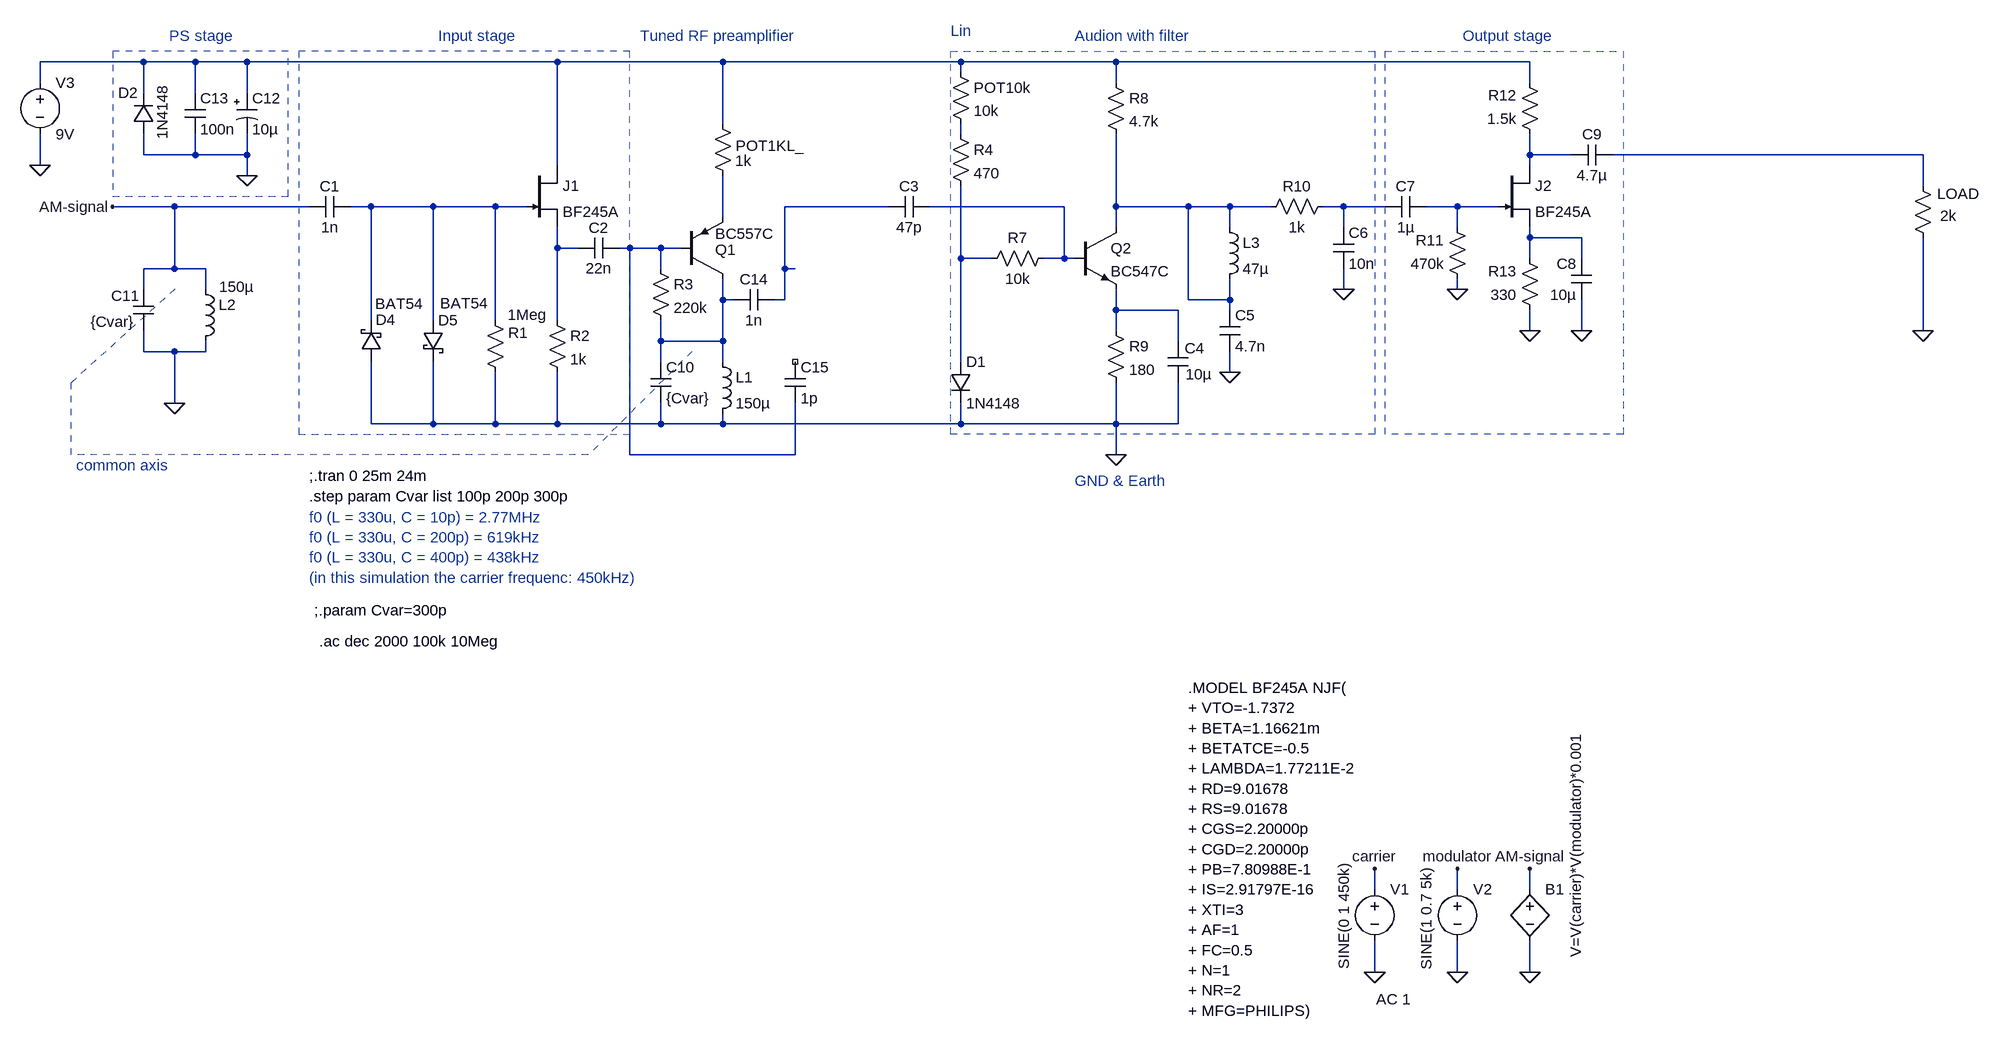
[diagram p0: schematic audion-receiver-4.asc]
audion-receiver-4.asc, the LTspice schematic file:
Version 4.1
SHEET 1 2156 1116
WIRE -688 -368 -848 -368
WIRE -608 -368 -688 -368
WIRE -528 -368 -608 -368
WIRE -48 -368 -528 -368
WIRE 208 -368 -48 -368
WIRE 576 -368 208 -368
WIRE 816 -368 576 -368
WIRE 1456 -368 816 -368
WIRE 576 -352 576 -368
WIRE -848 -336 -848 -368
WIRE 816 -336 816 -368
WIRE 1456 -336 1456 -368
WIRE -688 -320 -688 -368
WIRE -608 -320 -608 -368
WIRE -528 -320 -528 -368
WIRE 208 -272 208 -368
WIRE 576 -256 576 -272
WIRE -688 -224 -688 -256
WIRE -608 -224 -608 -256
WIRE -608 -224 -688 -224
WIRE -528 -224 -528 -256
WIRE -528 -224 -608 -224
WIRE 1456 -224 1456 -256
WIRE 1520 -224 1456 -224
WIRE 2064 -224 1584 -224
WIRE -848 -208 -848 -256
WIRE -48 -208 -48 -368
WIRE 1456 -208 1456 -224
WIRE -528 -192 -528 -224
WIRE 2064 -176 2064 -224
WIRE -640 -144 -736 -144
WIRE -432 -144 -640 -144
WIRE -336 -144 -368 -144
WIRE -240 -144 -336 -144
WIRE -144 -144 -240 -144
WIRE -96 -144 -144 -144
WIRE 464 -144 304 -144
WIRE 736 -144 528 -144
WIRE 816 -144 816 -256
WIRE 928 -144 816 -144
WIRE 992 -144 928 -144
WIRE 1056 -144 992 -144
WIRE 1168 -144 1136 -144
WIRE 1232 -144 1168 -144
WIRE 1344 -144 1296 -144
WIRE 1408 -144 1344 -144
WIRE 208 -128 208 -192
WIRE 816 -112 816 -144
WIRE 992 -112 992 -144
WIRE 1168 -112 1168 -144
WIRE 1344 -112 1344 -144
WIRE 1456 -96 1456 -112
WIRE 1536 -96 1456 -96
WIRE -48 -80 -48 -112
WIRE -16 -80 -48 -80
WIRE 64 -80 48 -80
WIRE 112 -80 64 -80
WIRE 144 -80 112 -80
WIRE 576 -64 576 -176
WIRE 624 -64 576 -64
WIRE 736 -64 736 -144
WIRE 736 -64 704 -64
WIRE 752 -64 736 -64
WIRE 1456 -64 1456 -96
WIRE 1536 -64 1536 -96
WIRE -640 -48 -640 -144
WIRE -640 -48 -688 -48
WIRE -592 -48 -640 -48
WIRE 112 -48 112 -80
WIRE 304 -48 304 -144
WIRE 320 -48 304 -48
WIRE -688 -16 -688 -48
WIRE -592 -16 -592 -48
WIRE 1168 -16 1168 -48
WIRE 1344 -16 1344 -32
WIRE 208 0 208 -32
WIRE 224 0 208 0
WIRE 304 0 304 -48
WIRE 304 0 288 0
WIRE 928 0 928 -144
WIRE 992 0 992 -32
WIRE 992 0 928 0
WIRE 816 16 816 -16
WIRE 912 16 816 16
WIRE 992 16 992 0
WIRE -336 32 -336 -144
WIRE -240 32 -240 -144
WIRE -144 32 -144 -144
WIRE -48 32 -48 -80
WIRE 816 48 816 16
WIRE 1456 48 1456 16
WIRE 1536 48 1536 0
WIRE 2064 48 2064 -96
WIRE 112 64 112 32
WIRE 208 64 208 0
WIRE 208 64 112 64
WIRE 912 64 912 16
WIRE -688 80 -688 48
WIRE -640 80 -688 80
WIRE -592 80 -592 64
WIRE -592 80 -640 80
WIRE 112 96 112 64
WIRE 208 96 208 64
WIRE 576 96 576 -64
WIRE 992 112 992 80
WIRE -640 160 -640 80
WIRE -336 192 -336 96
WIRE -240 192 -240 96
WIRE -240 192 -336 192
WIRE -144 192 -144 112
WIRE -144 192 -240 192
WIRE -48 192 -48 112
WIRE -48 192 -144 192
WIRE 112 192 112 160
WIRE 112 192 -48 192
WIRE 208 192 208 176
WIRE 208 192 112 192
WIRE 576 192 576 160
WIRE 576 192 208 192
WIRE 816 192 816 128
WIRE 816 192 576 192
WIRE 912 192 912 128
WIRE 912 192 816 192
WIRE 64 240 64 -80
WIRE 320 240 320 160
WIRE 320 240 64 240
WIRE 816 240 816 192
WIRE 1216 912 1216 880
WIRE 1344 912 1344 880
WIRE 1456 912 1456 880
WIRE 1216 1040 1216 992
WIRE 1344 1040 1344 992
WIRE 1456 1040 1456 992
FLAG 816 240 0
FLAG 1216 880 carrier
FLAG 1344 880 modulator
FLAG 1216 1040 0
FLAG 1344 1040 0
FLAG 1456 1040 0
FLAG 1456 880 AM-signal
FLAG -848 -208 0
FLAG 992 112 0
FLAG 1168 -16 0
FLAG 1344 -16 0
FLAG 1456 48 0
FLAG 1536 48 0
FLAG 2064 48 0
FLAG -736 -144 AM-signal
FLAG -640 160 0
FLAG -528 -192 0
SYMBOL npn 752 -112 R0
SYMATTR InstName Q2
SYMATTR Value BC547C
SYMBOL res 800 -352 R0
SYMATTR InstName R8
SYMATTR Value 4.7k
SYMBOL res 560 -368 R0
SYMATTR InstName POT10k
SYMATTR Value 10k
SYMBOL res 720 -80 R90
WINDOW 0 0 56 VBottom 2
WINDOW 3 32 56 VTop 2
SYMATTR InstName R7
SYMATTR Value 10k
SYMBOL diode 560 96 R0
SYMATTR InstName D1
SYMATTR Value 1N4148
SYMBOL res 800 32 R0
SYMATTR InstName R9
SYMATTR Value 180
SYMBOL voltage 1216 896 R0
WINDOW 3 -48 -25 VRight 2
WINDOW 123 2 186 Left 2
WINDOW 39 0 0 Left 0
SYMATTR Value SINE(0 1 450k)
SYMATTR Value2 AC 1
SYMATTR InstName V1
SYMBOL voltage 1344 896 R0
WINDOW 3 -48 -18 VRight 2
WINDOW 123 0 0 Left 0
WINDOW 39 0 0 Left 0
SYMATTR Value SINE(1 0.7 5k)
SYMATTR InstName V2
SYMBOL bv 1456 896 R0
WINDOW 3 71 -229 VRight 2
SYMATTR Value V=V(carrier)*V(modulator)*0.001
SYMATTR InstName B1
SYMBOL voltage -848 -352 R0
WINDOW 123 0 0 Left 0
WINDOW 39 0 0 Left 0
SYMATTR InstName V3
SYMATTR Value 9V
SYMBOL res 1152 -160 R90
WINDOW 0 0 56 VBottom 2
WINDOW 3 32 56 VTop 2
SYMATTR InstName R10
SYMATTR Value 1k
SYMBOL cap 1296 -160 R90
WINDOW 0 0 32 VBottom 2
WINDOW 3 32 32 VTop 2
SYMATTR InstName C7
SYMATTR Value 1µ
SYMBOL njf 1408 -208 R0
SYMATTR InstName J2
SYMATTR Value BF245A
SYMBOL res 1360 -16 R180
WINDOW 0 36 76 Left 2
WINDOW 3 36 40 Left 2
SYMATTR InstName R11
SYMATTR Value 470k
SYMBOL res 1472 32 R180
WINDOW 0 36 76 Left 2
WINDOW 3 36 40 Left 2
SYMATTR InstName R13
SYMATTR Value 330
SYMBOL res 1472 -240 R180
WINDOW 0 36 76 Left 2
WINDOW 3 36 40 Left 2
SYMATTR InstName R12
SYMATTR Value 1.5k
SYMBOL cap 1552 0 R180
WINDOW 0 24 56 Left 2
WINDOW 3 24 8 Left 2
SYMATTR InstName C8
SYMATTR Value 10µ
SYMBOL cap 1584 -240 R90
WINDOW 0 0 32 VBottom 2
WINDOW 3 32 32 VTop 2
SYMATTR InstName C9
SYMATTR Value 4.7µ
SYMBOL res 2080 -80 R180
WINDOW 0 -71 84 Left 2
WINDOW 3 -36 50 Left 2
SYMATTR InstName LOAD
SYMATTR Value 2k
SYMBOL cap 928 128 R180
WINDOW 0 -25 53 Left 2
WINDOW 3 -36 13 Left 2
SYMATTR InstName C4
SYMATTR Value 10µ
SYMBOL res 192 -288 R0
WINDOW 0 36 50 Left 2
WINDOW 3 35 73 Left 2
SYMATTR InstName POT1KL_
SYMATTR Value 1k
SYMBOL cap -368 -160 R90
WINDOW 0 0 32 VBottom 2
WINDOW 3 32 32 VTop 2
SYMATTR InstName C1
SYMATTR Value 1n
SYMBOL res 96 -64 R0
SYMATTR InstName R3
SYMATTR Value 220k
SYMBOL njf -96 -208 R0
SYMATTR InstName J1
SYMATTR Value BF245A
SYMBOL res -64 16 R0
SYMATTR InstName R2
SYMATTR Value 1k
SYMBOL cap 48 -96 R90
WINDOW 0 0 32 VBottom 2
WINDOW 3 32 32 VTop 2
SYMATTR InstName C2
SYMATTR Value 22n
SYMBOL res -128 128 R180
WINDOW 0 -35 77 Left 2
WINDOW 3 -64 105 Left 2
SYMATTR InstName R1
SYMATTR Value 1Meg
SYMBOL pnp 144 -32 M180
WINDOW 0 52 45 Left 2
WINDOW 3 52 70 Left 2
SYMATTR InstName Q1
SYMATTR Value BC557C
SYMBOL ind 192 80 R0
SYMATTR InstName L1
SYMATTR Value 150µ
SYMBOL cap 96 96 R0
SYMATTR InstName C10
SYMATTR Value {Cvar}
SYMBOL ind -608 -32 R0
WINDOW 3 37 12 Left 2
SYMATTR Value 150µ
SYMATTR InstName L2
SYMBOL cap -704 -16 R0
WINDOW 0 -34 10 Left 2
WINDOW 3 -66 50 Left 2
SYMATTR InstName C11
SYMATTR Value {Cvar}
SYMBOL schottky -320 96 R180
WINDOW 0 -22 65 Left 2
WINDOW 3 -64 90 Left 2
SYMATTR InstName D4
SYMATTR Value BAT54
SYMATTR Description Diode
SYMATTR Type diode
SYMBOL schottky -256 32 R0
WINDOW 3 100 -27 Right 2
SYMATTR Value BAT54
SYMATTR InstName D5
SYMATTR Description Diode
SYMATTR Type diode
SYMBOL polcap -544 -320 R0
SYMATTR InstName C12
SYMATTR Value 10µ
SYMBOL cap -624 -320 R0
SYMATTR InstName C13
SYMATTR Value 100n
SYMBOL diode -672 -256 R180
WINDOW 0 24 64 Left 2
WINDOW 3 -13 -8 VRight 2
SYMATTR InstName D2
SYMATTR Value 1N4148
SYMBOL res 560 -272 R0
SYMATTR InstName R4
SYMATTR Value 470
SYMBOL cap 1152 -112 R0
SYMATTR InstName C6
SYMATTR Value 10n
SYMBOL cap 976 16 R0
SYMATTR InstName C5
SYMATTR Value 4.7n
SYMBOL cap 288 -16 R90
WINDOW 0 0 32 VBottom 2
WINDOW 3 32 32 VTop 2
SYMATTR InstName C14
SYMATTR Value 1n
SYMBOL cap 528 -160 R90
WINDOW 0 0 32 VBottom 2
WINDOW 3 32 32 VTop 2
SYMATTR InstName C3
SYMATTR Value 47p
SYMBOL ind 976 -128 R0
SYMATTR InstName L3
SYMATTR Value 47µ
SYMBOL cap 304 96 R0
SYMATTR InstName C15
SYMATTR Value 1p
TEXT -432 272 Left 2 !;.tran 0 25m 24m
TEXT 928 600 Left 2 !.MODEL BF245A NJF( \n+ VTO=-1.7372 \n+ BETA=1.16621m \n+ BETATCE=-0.5 \n+ LAMBDA=1.77211E-2 \n+ RD=9.01678 \n+ RS=9.01678 \n+ CGS=2.20000p \n+ CGD=2.20000p \n+ PB=7.80988E-1 \n+ IS=2.91797E-16 \n+ XTI=3 \n+ AF=1 \n+ FC=0.5 \n+ N=1 \n+ NR=2 \n+ MFG=PHILIPS)
TEXT -232 -408 Left 2 ;Input stage
TEXT 80 -408 Left 2 ;Tuned RF preamplifier
TEXT 752 -408 Left 2 ;Audion with filter
TEXT 1352 -408 Left 2 ;Output stage
TEXT 752 280 Left 2 ;GND & Earth
TEXT -432 304 Left 2 !.step param Cvar list 100p 200p 300p
TEXT -432 336 Left 2 ;f0 (L = 330u, C = 10p) = 2.77MHz\nf0 (L = 330u, C = 200p) = 619kHz\nf0 (L = 330u, C = 400p) = 438kHz\n(in this simulation the carrier frequenc: 450kHz)
TEXT -792 256 Left 2 ;common axis
TEXT -648 -408 Left 2 ;PS stage
TEXT 560 -416 Left 2 ;Lin
TEXT -424 480 Left 2 !;.param Cvar=300p
TEXT -416 528 Left 2 !.ac dec 2000 100k 10Meg
LINE Normal 160 80 0 240 2
LINE Normal 0 240 -800 240 2
LINE Normal -640 -16 -800 128 2
LINE Normal -800 240 -800 128 2
RECTANGLE Normal 1216 208 560 -384 2
RECTANGLE Normal 1600 208 1232 -384 2
RECTANGLE Normal -448 208 64 -384 2
RECTANGLE Normal -736 -160 -464 -384 2

The netlist it stands for:
* audion-receiver-4.asc
Q2 N008 N007 N017 0 BC547C
R8 N001 N008 4.7k
R§POT10k N001 N002 10k
R7 N007 N015 10k
D1 N015 0 1N4148
R9 N017 0 180
V1 carrier 0 SINE(0 1 450k) AC 1
V2 modulator 0 SINE(1 0.7 5k)
B1 AM-signal 0 V=V(carrier)*V(modulator)*0.001
V3 N001 0 9V
R10 N009 N008 1k
C7 N010 N009 1µ
J2 N003 N010 N012 BF245A
R11 0 N010 470k
R13 0 N012 330
R12 N003 N001 1.5k
C8 0 N012 10µ
C9 N004 N003 4.7µ
R§LOAD 0 N004 2k
C4 0 N017 10µ
R§POT1KL_ N001 N011 1k
C1 N005 AM-signal 1n
R3 N014 N016 220k
J1 N001 N005 N013 BF245A
R2 N013 0 1k
C2 N014 N013 22n
R1 0 N005 1Meg
Q1 N016 N014 N011 0 BC557C
L1 N016 0 150µ
C10 N016 0 {Cvar}
L2 AM-signal 0 150µ
C11 AM-signal 0 {Cvar}
D4 0 N005 BAT54
D5 N005 0 BAT54
C12 N001 0 10µ
C13 N001 0 100n
D2 0 N001 1N4148
R4 N002 N015 470
C6 N009 0 10n
C5 N008 0 4.7n
C14 N006 N016 1n
C3 N007 N006 47p
L3 N008 N008 47µ
C15 NC_01 N014 1p
.model D D
.lib standard.dio
.model NPN NPN
.model PNP PNP
.lib standard.bjt
.model NJF NJF
.model PJF PJF
.lib standard.jft
;.tran 0 25m 24m
.MODEL BF245A NJF(
+ VTO=-1.7372
+ BETA=1.16621m
+ BETATCE=-0.5
+ LAMBDA=1.77211E-2
+ RD=9.01678
+ RS=9.01678
+ CGS=2.20000p
+ CGD=2.20000p
+ PB=7.80988E-1
+ IS=2.91797E-16
+ XTI=3
+ AF=1
+ FC=0.5
+ N=1
+ NR=2
+ MFG=PHILIPS)
* Input stage
* Tuned RF preamplifier
* Audion with filter
* Output stage
* GND & Earth
.step param Cvar list 100p 200p 300p
* f0 (L = 330u, C = 10p) = 2.77MHz
* f0 (L = 330u, C = 200p) = 619kHz
* f0 (L = 330u, C = 400p) = 438kHz
* (in this simulation the carrier frequenc: 450kHz)
* common axis
* PS stage
* Lin
;.param Cvar=300p
.ac dec 2000 100k 10Meg
.backanno
.end